# Altium schematic sheet Display_driver.SchDoc
size 594 x 420 mm; SheetNumber: 1; SheetTotal: 3
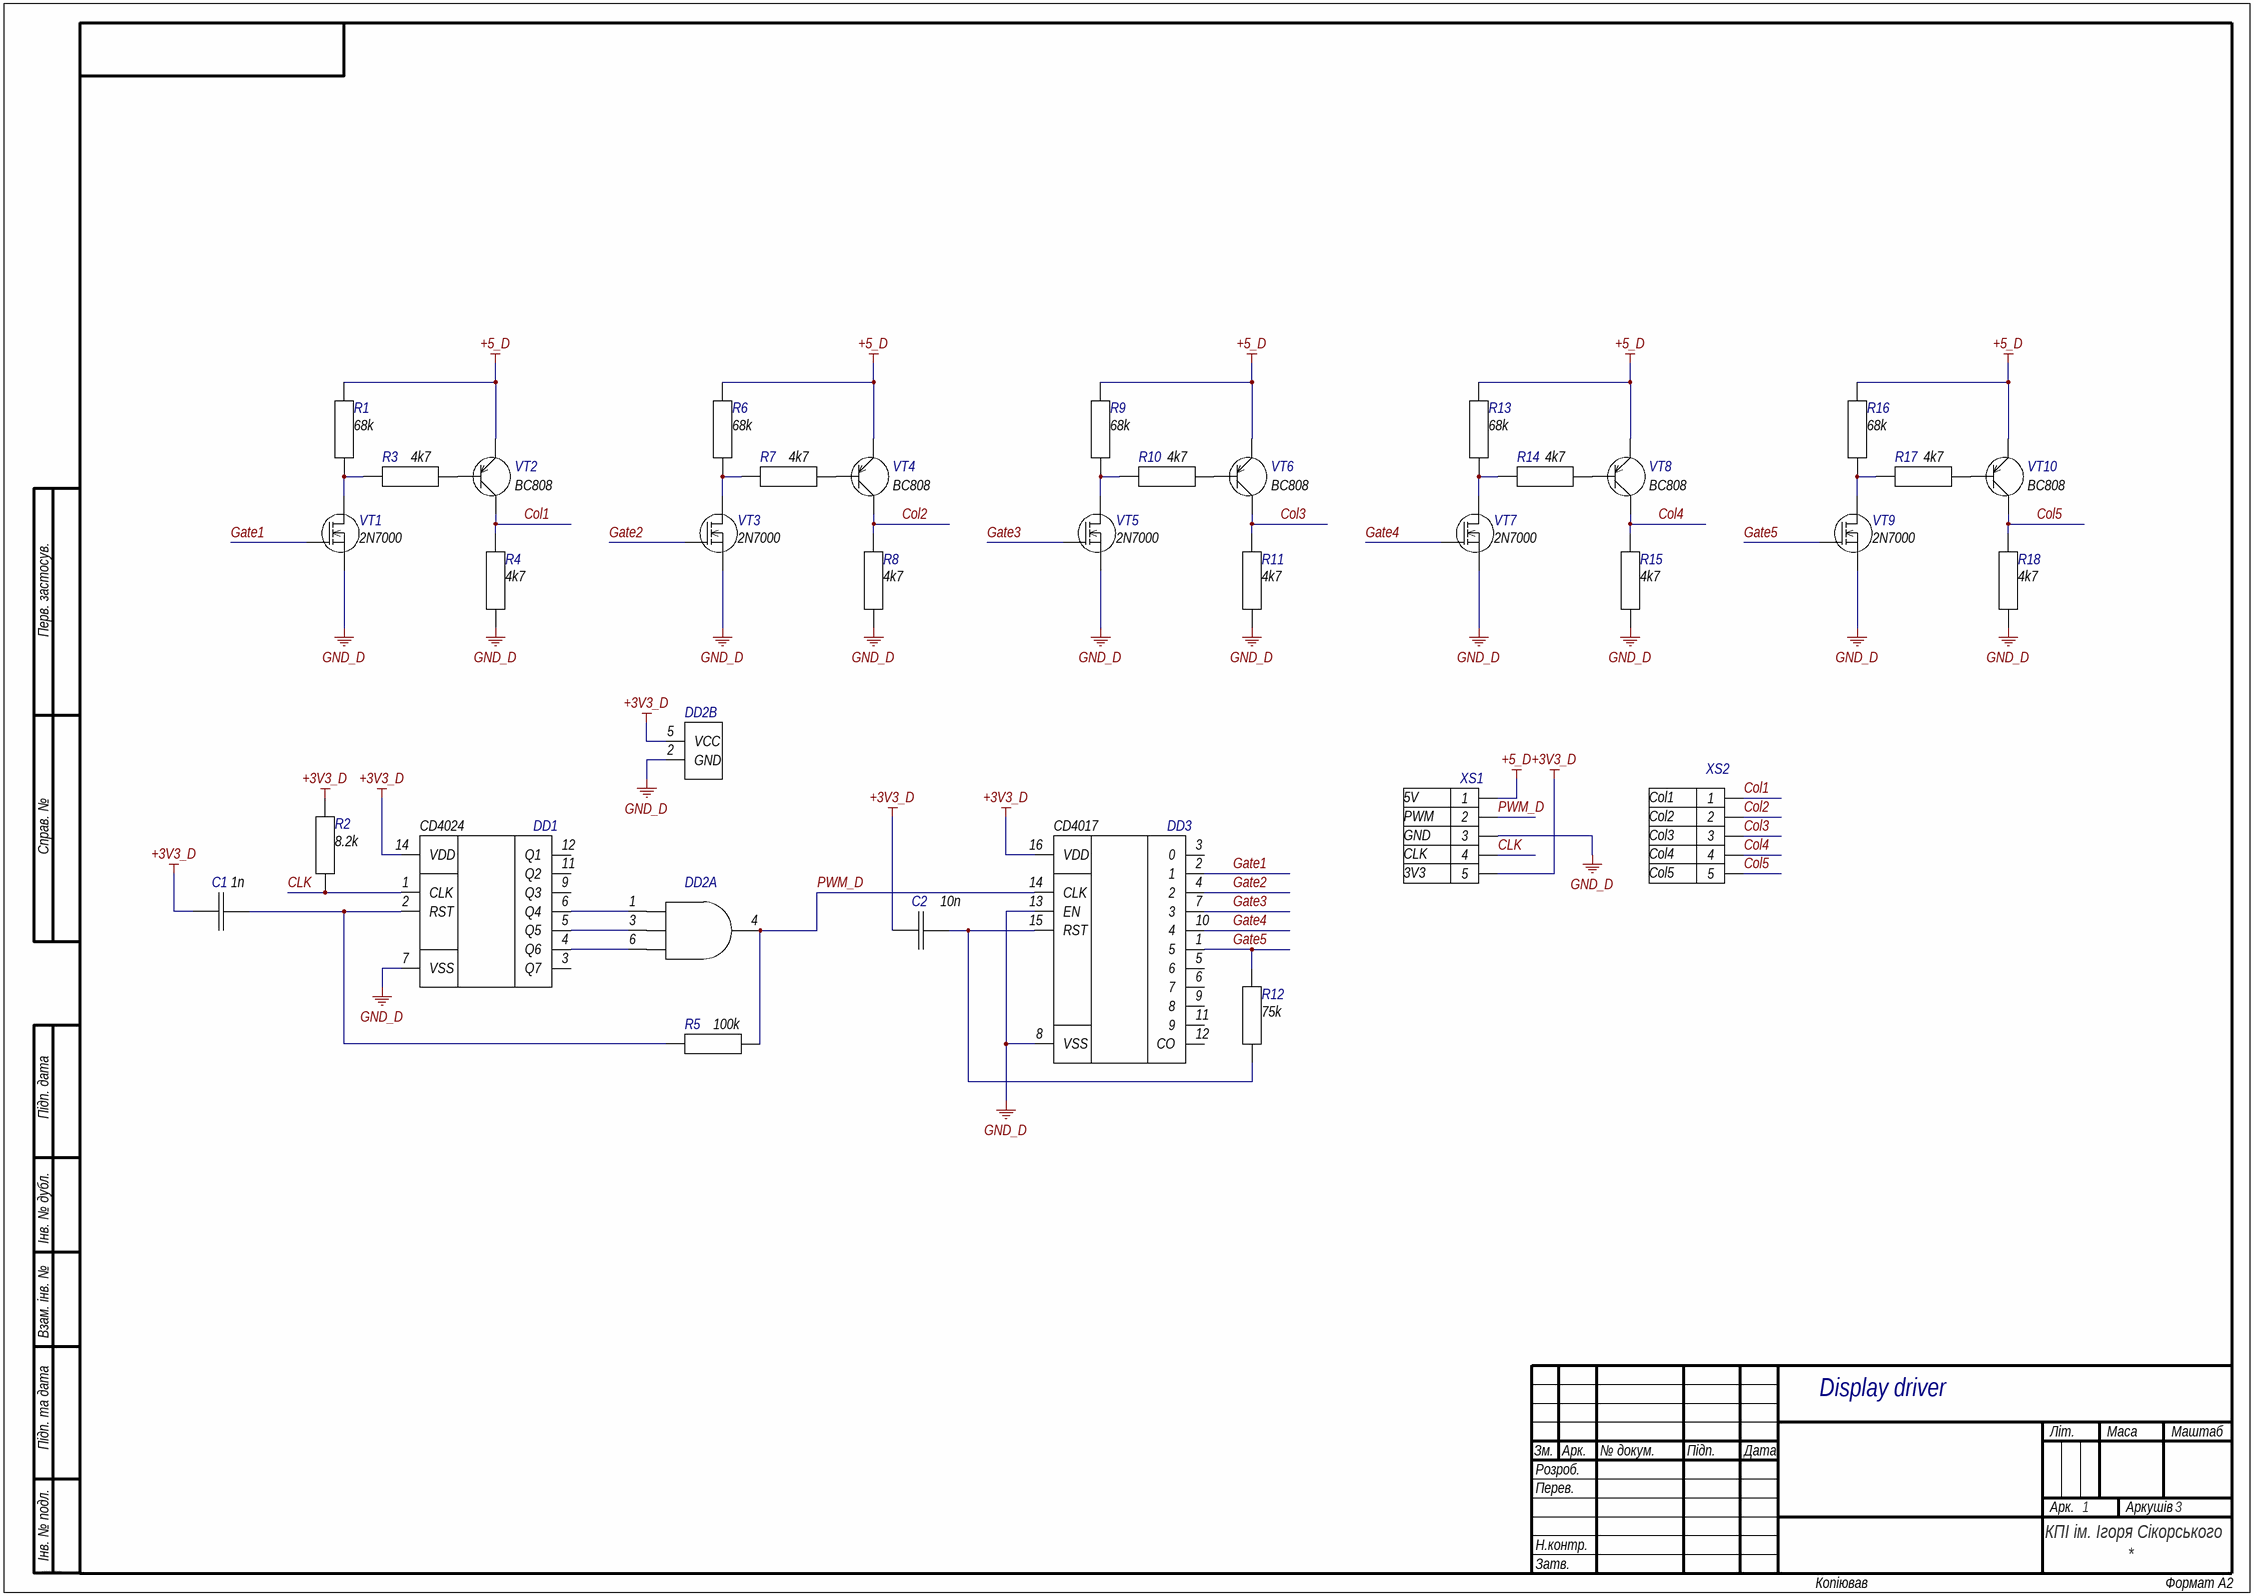
[diagram p0: Display_driver.SchDoc]

## Parts
C1  value 1n  [CHIP-0805]  (hidden comment: C0805)
C2  value 10n  [CHIP-0402]  (hidden comment: C0805)
DD1  CD4024  [SOIC-14]
DD2  74LVC1G11  [SOT23-6]  (value not drawn)  (parts A,B of 2)
DD3  CD4017  [SOIC-16]
R1  value 68k  [CHIP-0805]  (hidden comment: R0805)
R2  value 8.2k  [CHIP-0805]  (hidden comment: R0805)
R3  value 4k7  [CHIP-0402]  (hidden comment: R0805)
R4  value 4k7  [CHIP-0402]  (hidden comment: R0805)
R5  value 100k  [CHIP-0805]  (hidden comment: R0805)
R6  value 68k  [CHIP-0805]  (hidden comment: R0805)
R7  value 4k7  [CHIP-0402]  (hidden comment: R0805)
R8  value 4k7  [CHIP-0402]  (hidden comment: R0805)
R9  value 68k  [CHIP-0805]  (hidden comment: R0805)
R10  value 4k7  [CHIP-0402]  (hidden comment: R0805)
R11  value 4k7  [CHIP-0402]  (hidden comment: R0805)
R12  value 75k  [CHIP-0402]  (hidden comment: R0805)
R13  value 68k  [CHIP-0805]  (hidden comment: R0805)
R14  value 4k7  [CHIP-0402]  (hidden comment: R0805)
R15  value 4k7  [CHIP-0402]  (hidden comment: R0805)
R16  value 68k  [CHIP-0805]  (hidden comment: R0805)
R17  value 4k7  [CHIP-0402]  (hidden comment: R0805)
R18  value 4k7  [CHIP-0402]  (hidden comment: R0805)
VT1  2N7000  [SOT23-3]
VT2  BC808  [SOT23-3]
VT3  2N7000  [SOT23-3]
VT4  BC808  [SOT23-3]
VT5  2N7000  [SOT23-3]
VT6  BC808  [SOT23-3]
VT7  2N7000  [SOT23-3]
VT8  BC808  [SOT23-3]
VT9  2N7000  [SOT23-3]
VT10  BC808  [SOT23-3]
XS1  Pin5: 3V3  Pin4: CLK  Pin3: GND  Pin2: PWM  Pin1: 5V  [SOCKET]  (hidden comment: Socket)
XS2  Pin5: Col5  Pin4: Col4  Pin3: Col3  Pin2: Col2  Pin1: Col1  [SOCKET]  (hidden comment: Socket)

## Nets
+3V3_D: C1.1 C2.1 DD1.14(VDD) DD2.5(VCC) DD3.16(VDD) R2.2 XS1.5
+5_D: R1.2 R6.2 R9.2 R13.2 R16.2 VT2.2(E) VT4.2(E) VT6.2(E) VT8.2(E) VT10.2(E) XS1.1
GND_D: DD1.7(VSS) DD2.2(GND) DD3.8(VSS) DD3.13(EN) R4.1 R8.1 R11.1 R15.1 R18.1 VT1.2(S) VT3.2(S) VT5.2(S) VT7.2(S) VT9.2(S) XS1.3
CLK: DD1.1(CLK) R2.1 XS1.4
Col1: R4.2 VT2.3(C) XS2.1
Col2: R8.2 VT4.3(C) XS2.2
Col3: R11.2 VT6.3(C) XS2.3
Col4: R15.2 VT8.3(C) XS2.4
Col5: R18.2 VT10.3(C) XS2.5
Gate1: DD3.2(1) VT1.1(G)
Gate2: DD3.4(2) VT3.1(G)
Gate3: DD3.7(3) VT5.1(G)
Gate4: DD3.10(4) VT7.1(G)
Gate5: DD3.1(5) R12.2 VT9.1(G)
PWM_D: DD2.4(Y) DD3.14(CLK) R5.2 XS1.2
NetC1_2: C1.2 DD1.2(RST) R5.1
NetC2_2: C2.2 DD3.15(RST) R12.1
NetDD1_4: DD1.4(Q6) DD2.6(C)
NetDD1_5: DD1.5(Q5) DD2.3(B)
NetDD1_6: DD1.6(Q4) DD2.1(A)
NetR1_1: R1.1 R3.1 VT1.3(D)
NetR3_2: R3.2 VT2.1(B)
NetR6_1: R6.1 R7.1 VT3.3(D)
NetR7_2: R7.2 VT4.1(B)
NetR9_1: R9.1 R10.1 VT5.3(D)
NetR10_2: R10.2 VT6.1(B)
NetR13_1: R13.1 R14.1 VT7.3(D)
NetR14_2: R14.2 VT8.1(B)
NetR16_1: R16.1 R17.1 VT9.3(D)
NetR17_2: R17.2 VT10.1(B)

Not connected (* = marked no-connect by the designer): DD1 3(Q7) 9(Q3) 11(Q2) 12(Q1); DD3 3(0) 5(6) 6(7) 9(8) 11(9) 12(CO)

## Notes on the sheet
- Display driver
- Перв. застосув.
- Справ. №
- Підп. дата
- Інв. № дубл.
- Взам. інв. №
- Підп. та дата
- Зм.
- Розроб.
- Арк.
- № докум.
- Підп.
- Дата
- Літ.
- Маса
- Маштаб
- Перев.
- Аркушів
- Інв. № подл.
- Н.контр.
- Затв.
- КПІ ім. Ігоря Сікорського
- ALTIUM GOSTBOM2.0 KEV
- Копіював
- Формат А2

## Library data of the parts
DD1 = CD4024: Name: CD4024
DD3 = CD4017: Name: CD4017
VT1 VT3 VT5 VT7 VT9 = 2N7000: Name: 2N7000
VT2 VT4 VT6 VT8 VT10 = BC808: Name: BC808